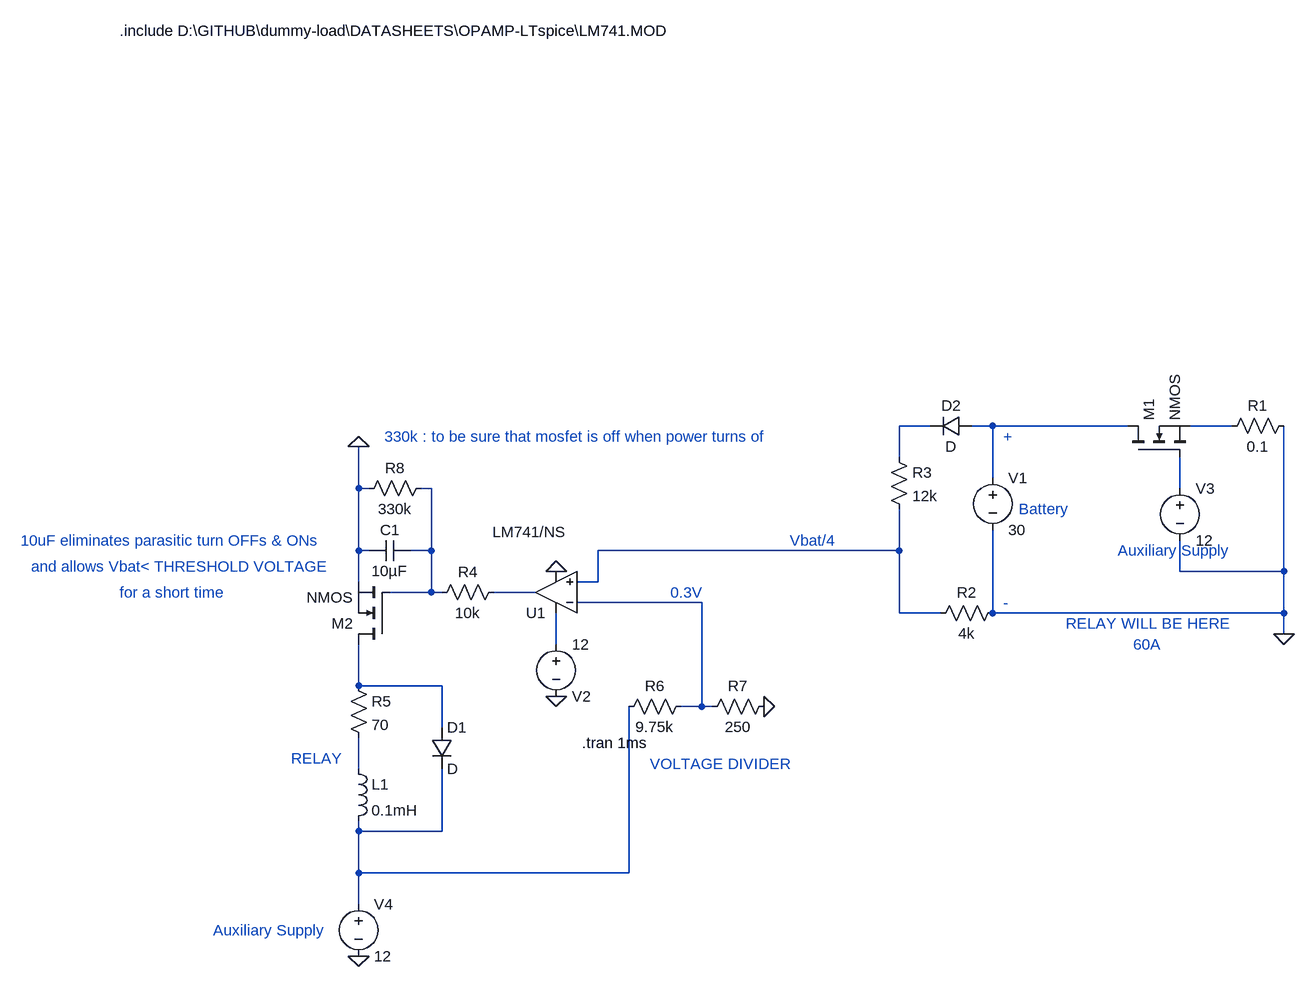
[diagram p0: schematic REVERSE VOLTAGE PROTECTION WITH RELAY.asc]
REVERSE VOLTAGE PROTECTION WITH RELAY.asc, the LTspice schematic file:
Version 4
SHEET 1 880 708
WIRE -160 -128 -208 -128
WIRE -64 -128 -96 -128
WIRE 144 -128 -64 -128
WIRE 304 -128 240 -128
WIRE -208 -80 -208 -128
WIRE -64 -48 -64 -128
WIRE -1040 -32 -1040 -96
WIRE -1024 -32 -1040 -32
WIRE -928 -32 -944 -32
WIRE 224 -32 224 -80
WIRE -1040 64 -1040 -32
WIRE -1024 64 -1040 64
WIRE -928 64 -928 -32
WIRE -928 64 -960 64
WIRE -208 64 -208 0
WIRE -208 64 -672 64
WIRE 224 96 224 48
WIRE 384 96 384 -128
WIRE 384 96 224 96
WIRE -1040 112 -1040 64
WIRE -672 112 -672 64
WIRE -672 112 -704 112
WIRE -928 128 -928 64
WIRE -928 128 -992 128
WIRE -912 128 -928 128
WIRE -768 128 -832 128
WIRE -512 144 -704 144
WIRE -208 160 -208 64
WIRE -144 160 -208 160
WIRE -64 160 -64 32
WIRE 384 160 384 96
WIRE 384 160 -64 160
WIRE 384 192 384 160
WIRE -736 208 -736 160
WIRE -1040 272 -1040 208
WIRE -912 272 -1040 272
WIRE -512 304 -512 144
WIRE -512 304 -544 304
WIRE -496 304 -512 304
WIRE -912 336 -912 272
WIRE -1040 400 -1040 352
WIRE -1040 496 -1040 480
WIRE -912 496 -912 400
WIRE -912 496 -1040 496
WIRE -1040 560 -1040 496
WIRE -624 560 -624 304
WIRE -624 560 -1040 560
WIRE -1040 608 -1040 560
FLAG 384 192 0
FLAG -736 96 0
FLAG -736 288 0
FLAG -1040 688 0
FLAG -416 304 0
FLAG -1040 -96 0
SYMBOL res 400 -144 R90
WINDOW 0 0 56 VBottom 2
WINDOW 3 32 56 VTop 2
SYMATTR InstName R1
SYMATTR Value 0.1
SYMBOL OpAmps\\opamp2 -736 192 R180
WINDOW 3 -16 157 Left 2
SYMATTR Value LM741/NS
SYMATTR InstName U1
SYMBOL voltage -736 192 R0
WINDOW 0 24 96 Left 2
WINDOW 3 24 16 Left 2
WINDOW 123 0 0 Left 0
WINDOW 39 0 0 Left 0
SYMATTR InstName V2
SYMATTR Value 12
SYMBOL res -48 144 R90
WINDOW 0 0 56 VBottom 2
WINDOW 3 32 56 VTop 2
SYMATTR InstName R2
SYMATTR Value 4k
SYMBOL voltage -64 -64 R0
WINDOW 123 0 0 Left 0
WINDOW 39 0 0 Left 0
SYMATTR InstName V1
SYMATTR Value 30
SYMBOL nmos 144 -80 R270
SYMATTR InstName M1
SYMBOL diode -96 -144 R90
WINDOW 0 0 32 VBottom 2
WINDOW 3 32 32 VTop 2
SYMATTR InstName D2
SYMBOL res -224 -96 R0
SYMATTR InstName R3
SYMATTR Value 12k
SYMBOL nmos -992 208 R180
SYMATTR InstName M2
SYMBOL res -928 144 R270
WINDOW 0 32 56 VTop 2
WINDOW 3 0 56 VBottom 2
SYMATTR InstName R4
SYMATTR Value 10k
SYMBOL res -1056 256 R0
SYMATTR InstName R5
SYMATTR Value 70
SYMBOL ind -1056 384 R0
SYMATTR InstName L1
SYMATTR Value 0.1mH
SYMBOL voltage -1040 592 R0
WINDOW 123 0 0 Left 0
WINDOW 39 0 0 Left 0
SYMATTR InstName V4
SYMATTR Value 12
SYMBOL diode -928 336 R0
SYMATTR InstName D1
SYMBOL res -528 288 R90
WINDOW 0 0 56 VBottom 2
WINDOW 3 32 56 VTop 2
SYMATTR InstName R6
SYMATTR Value 9.75k
SYMBOL res -400 288 R90
WINDOW 0 0 56 VBottom 2
WINDOW 3 32 56 VTop 2
SYMATTR InstName R7
SYMATTR Value 250
SYMBOL cap -960 48 R90
WINDOW 0 0 32 VBottom 2
WINDOW 3 32 32 VTop 2
SYMATTR InstName C1
SYMATTR Value 10µF
SYMBOL res -928 -48 R90
WINDOW 0 0 56 VBottom 2
WINDOW 3 32 56 VTop 2
SYMATTR InstName R8
SYMATTR Value 330k
SYMBOL voltage 224 -48 R0
WINDOW 123 0 0 Left 0
WINDOW 39 0 0 Left 0
SYMATTR InstName V3
SYMATTR Value 12
TEXT -696 360 Left 2 !.tran 1ms
TEXT -1408 -736 Left 2 !.include D:\\GITHUB\\dummy-load\\DATASHEETS\\OPAMP-LTspice\\LM741.MOD
TEXT 48 176 Left 2 ;RELAY WILL BE HERE
TEXT 152 208 Left 2 ;60A
TEXT -1144 384 Left 2 ;RELAY
TEXT -592 392 Left 2 ;VOLTAGE DIVIDER
TEXT -1000 -112 Left 2 ;330k : to be sure that mosfet is off when power turns of
TEXT -1560 48 Left 2 ;10uF eliminates parasitic turn OFFs & ONs
TEXT -1544 88 Left 2 ;and allows Vbat< THRESHOLD VOLTAGE
TEXT -1264 648 Left 2 ;Auxiliary Supply
TEXT 128 64 Left 2 ;Auxiliary Supply
TEXT -24 0 Left 2 ;Battery
TEXT -48 -112 Left 2 ;+
TEXT -48 144 Left 2 ;-
TEXT -376 48 Left 2 ;Vbat/4
TEXT -560 128 Left 2 ;0.3V
TEXT -1408 128 Left 2 ;for a short time

The netlist it stands for:
* REVERSE VOLTAGE PROTECTION WITH RELAY.asc
R1 0 N003 0.1
XU1 N006 N008 N009 0 N007 LM741/NS  ; pins In+ In- V+ V- OUT
V2 N009 0 12
R2 0 N006 4k
V1 N002 0 30
M1 N002 N005 N003 N003 NMOS
D2 N002 N001 D
R3 N001 N006 12k
M2 N010 N004 0 0 NMOS
R4 N004 N007 10k
R5 N010 N011 70
L1 N011 N012 0.1mH
V4 N012 0 12
D1 N010 N012 D
R6 N008 N012 9.75k
R7 0 N008 250
C1 N004 0 10µF
R8 N004 0 330k
V3 N005 0 12
.model D D
.lib standard.dio
.model NMOS NMOS
.model PMOS PMOS
.lib standard.mos
.tran 1ms
.include D:\GITHUB\dummy-load\DATASHEETS\OPAMP-LTspice\LM741.MOD
* RELAY WILL BE HERE
* 60A
* RELAY
* VOLTAGE DIVIDER
* 330k : to be sure that mosfet is off when power turns of
* 10uF eliminates parasitic turn OFFs & ONs
* and allows Vbat< THRESHOLD VOLTAGE
* Auxiliary Supply
* Auxiliary Supply
* Battery
* +
* -
* Vbat/4
* 0.3V
* for a short time
.backanno
.end